# EAGLE design charger v1 (EAGLE 5.10)
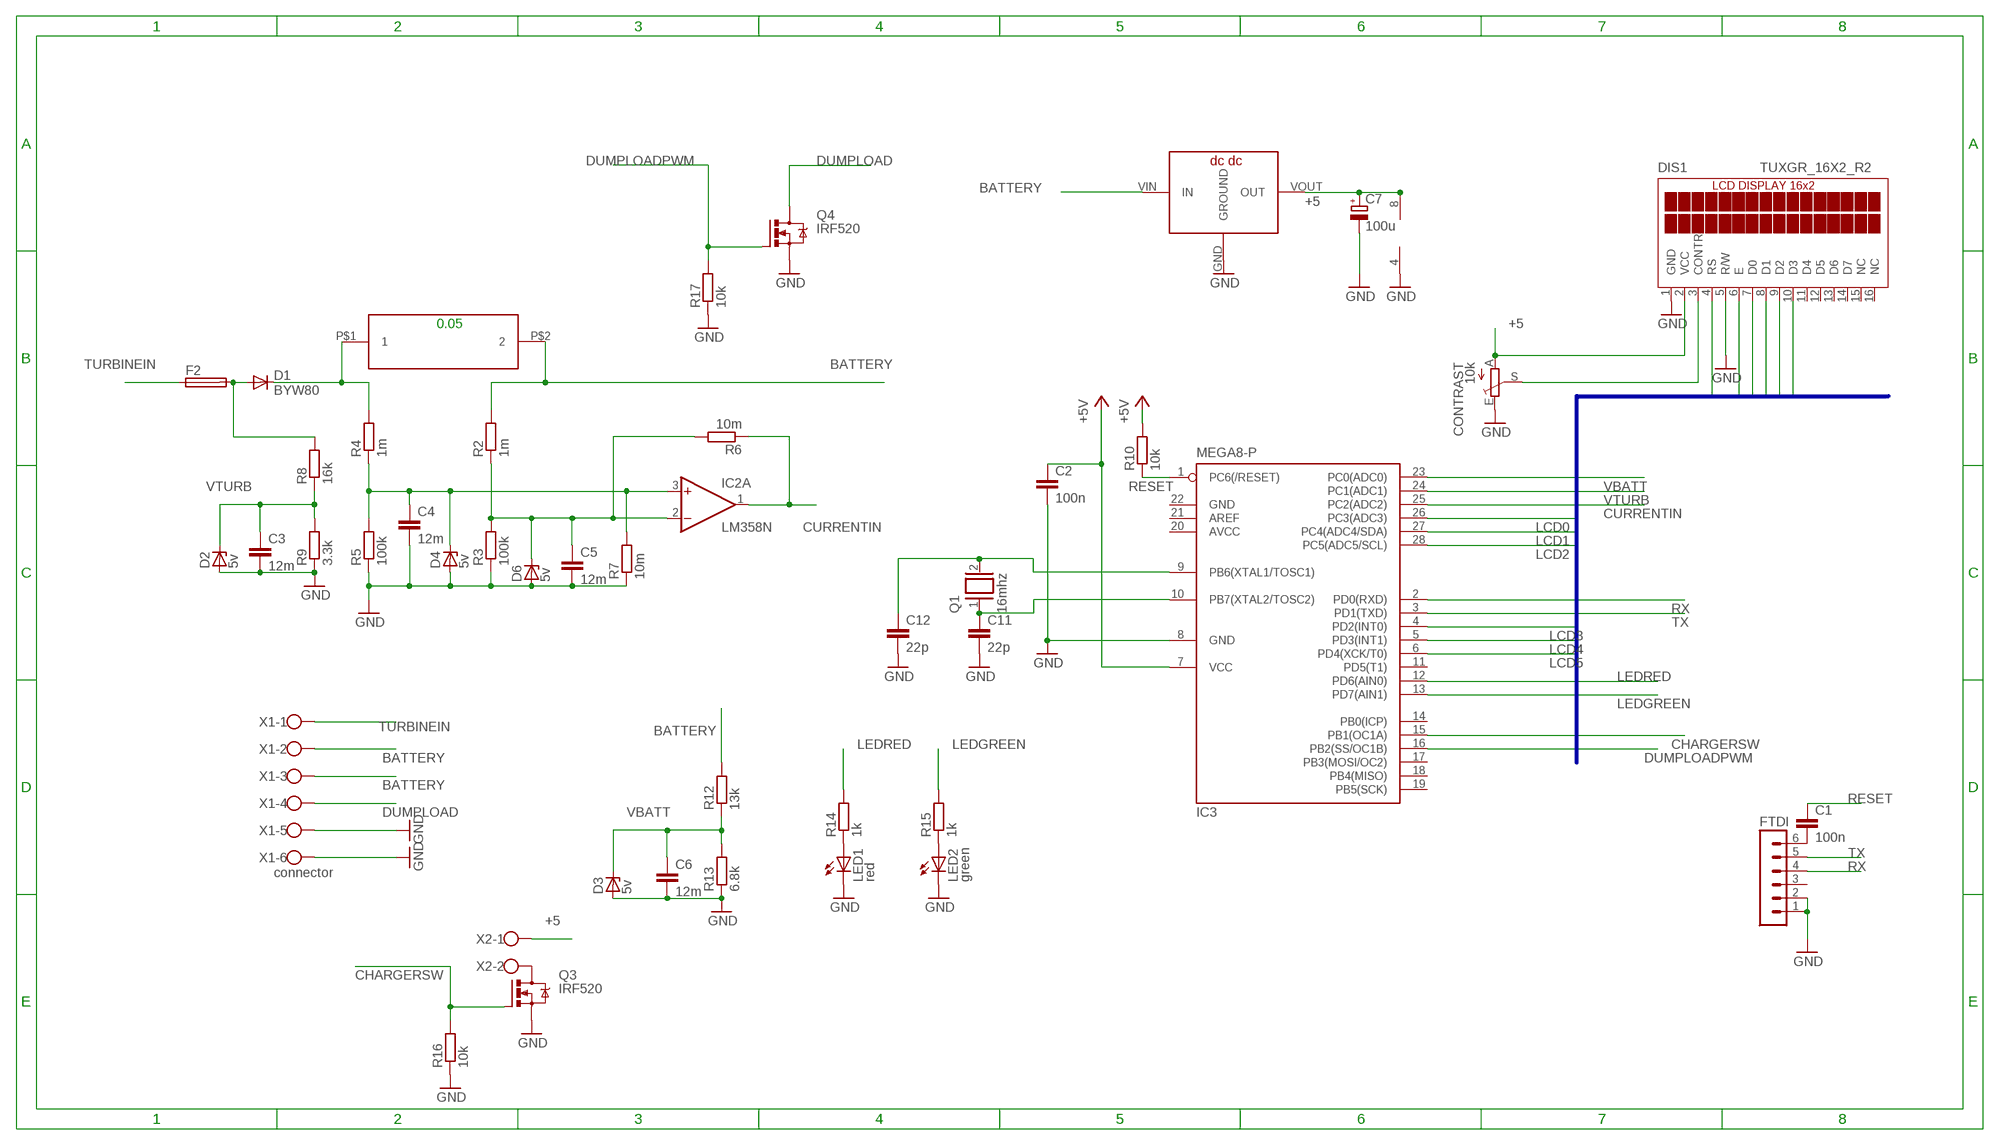
[diagram p0: schematic, sheet 1]

## Parts
C1  100n  C5/2.5  [C5B2.5]
C2  100n  C5/2.5  [C5B2.5]
C3  12m  C5/2.5  [C5B2.5]
C4  12m  C5/2.5  [C5B2.5]
C5  12m  C5/2.5  [C5B2.5]
C6  12m  C5/2.5  [C5B2.5]
C7  100u  CPOL-EUE2,5-6E  [E2,5-6E]
C11  22p  C-EU050-025X075  [C050-025X075]
C12  22p  C-EU050-025X075  [C050-025X075]
CONTRAST  10k  TRIM_EU-CA9V  [CA9V]
D1  BYW80  [TO220ACS]
D2  5v  ZENER-DIODEDO34-7  [DO34Z7]
D3  5v  ZENER-DIODEDO34-7  [DO34Z7]
D4  5v  ZENER-DIODEDO34-7  [DO34Z7]
D6  5v  ZENER-DIODEDO34-7  [DO34Z7]
DIS1  TUXGR_16X2_R2  [TUXGR_16X2_R2]
F2  SH22,5  [SH22,5]
FTDI  MA06-1  [MA06-1]
IC2  LM358N  [DIL08]
IC3  MEGA8-P  [DIL28-3]
LED1  red  LED5MM  [LED5MM]
LED2  green  LED5MM  [LED5MM]
Q1  16mhz  XTAL/S  [QS]
Q3  IRF520  [TO220BV]
Q4  IRF520  [TO220BV]
R2  1m  R-EU_0204/7  [0204/7]
R3  100k  R-EU_0204/7  [0204/7]
R4  1m  R-EU_0204/7  [0204/7]
R5  100k  R-EU_0204/7  [0204/7]
R6  10m  R-EU_0204/7  [0204/7]
R7  10m  R-EU_0204/7  [0204/7]
R8  16k  R-EU_0204/7  [0204/7]
R9  3.3k  R-EU_0204/7  [0204/7]
R10  10k  R-EU_0204/7  [0204/7]
R12  13k  R-EU_0204/7  [0204/7]
R13  6.8k  R-EU_0204/7  [0204/7]
R14  1k  R-EU_0204/7  [0204/7]
R15  1k  R-EU_0204/7  [0204/7]
R16  10k  R-EU_0204/7  [0204/7]
R17  10k  R-EU_0204/7  [0204/7]
U$1  R-5MM  [R-5MM]
U$2  TSR1-DCDC  [TSR1-DCDC]
X1  connector  W237-6  [W237-6]
X2  W237-102  [W237-102]

## Nets
+5: C2.1 C7.+ CONTRAST.A DIS1.2(VCC) IC2.8(P:V+) IC3.7(VCC) R10.2 U$2.VOUT(OUT) X2.1 ; supply symbol labelled +5V
BATTERY [power]: R2.2 R12.2 U$1.P$2 U$2.VIN(IN) X1.2 X1.3
CHARGERSW: IC3.15(PB1(OC1A)) Q3.G R16.2
CURRENTIN: IC2.1(A:OUT) IC3.25(PC2(ADC2)) R6.1
DUMPLOAD [power]: Q4.D X1.4
DUMPLOADPWM: IC3.16(PB2(SS/OC1B)) Q4.G R17.2
GND: C2.2 C3.2 C4.2 C5.2 C6.2 C7.- C11.2 C12.2 CONTRAST.E D2.A D3.A D4.A D6.A DIS1.1(GND) DIS1.5(R/W) FTDI.1 FTDI.2 IC2.4(P:V-) IC3.8(GND) LED1.K(C) LED2.K(C) Q3.S Q4.S R3.1 R5.1 R7.1 R9.1 R13.1 R16.1 R17.1 U$2.GND(GROUND) X1.5 X1.6
LCD0: DIS1.4(RS) IC3.26(PC3(ADC3))
LCD1: DIS1.6(E) IC3.27(PC4(ADC4/SDA))
LCD2: DIS1.7(D0) IC3.28(PC5(ADC5/SCL))
LCD3: DIS1.8(D1) IC3.4(PD2(INT0))
LCD4: DIS1.9(D2) IC3.5(PD3(INT1))
LCD5: DIS1.10(D3) IC3.6(PD4(XCK/T0))
LEDGREEN: IC3.13(PD7(AIN1)) R15.2
LEDRED: IC3.12(PD6(AIN0)) R14.2
N$1 [power]: D1.C R4.2 U$1.P$1
N$3: D1.A F2.2 R8.2
N$5: C1.2 FTDI.6
N$6: Q3.D X2.2
N$9: CONTRAST.S DIS1.3(CONTR)
N$10: C11.1 IC3.10(PB7(XTAL2/TOSC2)) Q1.1
N$11: C12.1 IC3.9(PB6(XTAL1/TOSC1)) Q1.2
N$13: LED1.A R14.1
N$15: LED2.A R15.1
N$16 [power]: C4.1 D4.C IC2.3(A:+IN) R4.1 R5.2 R7.2
N$17 [power]: C5.1 D6.C IC2.2(A:-IN) R2.1 R3.2 R6.2
RESET: C1.1 IC3.1(PC6(/RESET)) R10.1
RX: FTDI.4 IC3.2(PD0(RXD))
TURBINEIN [power]: F2.1 X1.1
TX: FTDI.5 IC3.3(PD1(TXD))
VBATT: C6.1 D3.C IC3.23(PC0(ADC0)) R12.1 R13.2
VTURB: C3.1 D2.C IC3.24(PC1(ADC1)) R8.1 R9.2
Unconnected: DIS1.11(D4) DIS1.12(D5) DIS1.13(D6) DIS1.14(D7) DIS1.15(NC) DIS1.16(NC) FTDI.3 IC2.5(B:+IN) IC2.6(B:-IN) IC2.7(B:OUT) IC3.11(PD5(T1)) IC3.14(PB0(ICP)) IC3.17(PB3(MOSI/OC2)) IC3.18(PB4(MISO)) IC3.19(PB5(SCK)) IC3.21(AREF)

## Buses
LCD[0..5]

## Notes on the sheet
- 0.05

## Power pins joined to a net without a drawn wire
AVCC: IC3.20(AVCC)
GND: IC3.22(GND)

## Library data of the parts
C1-C6 = capacitor-wima:C: CAPACITOR naming: grid - package width
C7 = rcl:CPOL-EU: POLARIZED CAPACITOR, European symbol
C11 C12 = rcl:C-EU: CAPACITOR, European symbol
CONTRAST = pot:TRIM_EU-: POTENTIOMETER
D1 = diode:BYW80: DIODE high-efficiency fast recovery rectifier (ST)
D2-D4 D6 = diode:ZENER-DIODE: Z-Diode
DIS1 = display-lcd:TUXGR_16X2_R2: Tuxgraphics LCD display 16x2 characters reflective, without background light Source: tuxgr_12x2_r2.pdf
F2 = fuse:SH22,5: FUSE HOLDER grid 22,5 mm, OGN0031 8201, Schurter (Buerklin)
FTDI = con-lstb:MA06-1: PIN HEADER
IC2 = linear:LM358: OP AMP also LM158; LM258; LM2904 Source: http://cache.national.com/ds/LM/LM158.pdf
IC3 = atmel:MEGA8-P: MICROCONTROLLER 8 Kbytes FLASH, 1 kbytes SRAM, 512 bytes EEPROM, USART, 4-channel 10 bit ADC, 2-channel 8 bit ADC Pin compatible with Atmega48, ATMega88, ATMega168 Source: avr.lbr
LED1 LED2 = led:LED: LED OSRAM: - CHIPLED LG R971, LG N971, LY N971, LG Q971, LY Q971, LO R971, LY R971 LH N974, LH R974 LS Q976, LO Q976, LY Q976 LO Q996 - Hyper CHIPLED LW Q18S LB Q993, LB Q99A, LB R99A - SideLED LS A670, LO A670, LY A670, LG A670, LP A670 LB A673, LV A673, LT A673, LW A673 LH A674 LY A675 LS A676, LA A676, LO A676, LY A676, LW A676 LS A679, LY A679, LG A679 - Hyper Micro SIDELED® LS Y876, LA Y876, LO Y876, LY Y876 LT Y87S - SmartLED LW L88C, LW L88S LB L89C, LB L89S, LG L890 LS L89K, LO L89K, LY L89K LS L896, LA L896, LO L896, LY L896 - TOPLED LS T670, LO T670, LY T670, LG T670, LP T670 LSG T670, LSP T670, LSY T670, LOP T670, LYG T670 LG T671, LOG T671, LSG T671 LB T673, LV T673, LT T673, LW T673 LH T674 LS T676, LA T676, LO T676, LY T676, LB T676, LH T676, LSB T676, LW T676 LB T67C, LV T67C, LT T67C, LS T67K, LO T67K, LY T67K, LW E67C LS E67B, LA E67B, LO E67B, LY E67B, LB E67C, LV E67C, LT E67C LW T67C LS T679, LY T679, LG T679 LS T770, LO T770, LY T770, LG T770, LP T770 LB T773, LV T773, LT T773, LW T773 LH T774 LS E675, LA E675, LY E675, LS T675 LS T776, LA T776, LO T776, LY T776, LB T776 LHGB T686 LT T68C, LB T68C - Hyper Mini TOPLED® LB M676 - Mini TOPLED Santana® LG M470 LS M47K, LO M47K, LY M47K Source: http://www.osram.convergy.de LUXEON: - LUMILED® LXK2-PW12-R00, LXK2-PW12-S00, LXK2-PW14-U00, LXK2-PW14-V00 LXK2-PM12-R00, LXK2-PM12-S00, LXK2-PM14-U00 LXK2-PE12-Q00, LXK2-PE12-R00, LXK2-PE12-S00, LXK2-PE14-T00, LXK2-PE14-U00 LXK2-PB12-K00, LXK2-PB12-L00, LXK2-PB12-M00, LXK2-PB14-N00, LXK2-PB14-P00, LXK2-PB14-Q00 LXK2-PR12-L00, LXK2-PR12-M00, LXK2-PR14-Q00, LXK2-PR14-R00 LXK2-PD12-Q00, LXK2-PD12-R00, LXK2-PD12-S00 LXK2-PH12-R00, LXK2-PH12-S00 LXK2-PL12-P00, LXK2-PL12-Q00, LXK2-PL12-R00 Source: www.luxeon.com KINGBRIGHT: KA-3528ASYC Source: www.kingbright.com
Q1 = special:XTAL/S: CRYSTAL
Q3 Q4 = transistor-power:IRF520: HEXFET Power MOSFET
R2-R10 R12-R17 = rcl:R-EU_: RESISTOR, European symbol
U$1 = matt:R-5MM
U$2 = matt:TSR1-DCDC: traco dc/dc converter tsr-1 series
X1 = con-wago-500:W237-6: WAGO SCREW CLAMP
X2 = con-wago-500:W237-102: WAGO SCREW CLAMP

## Net classes
1 power: width 2 mm

## Board
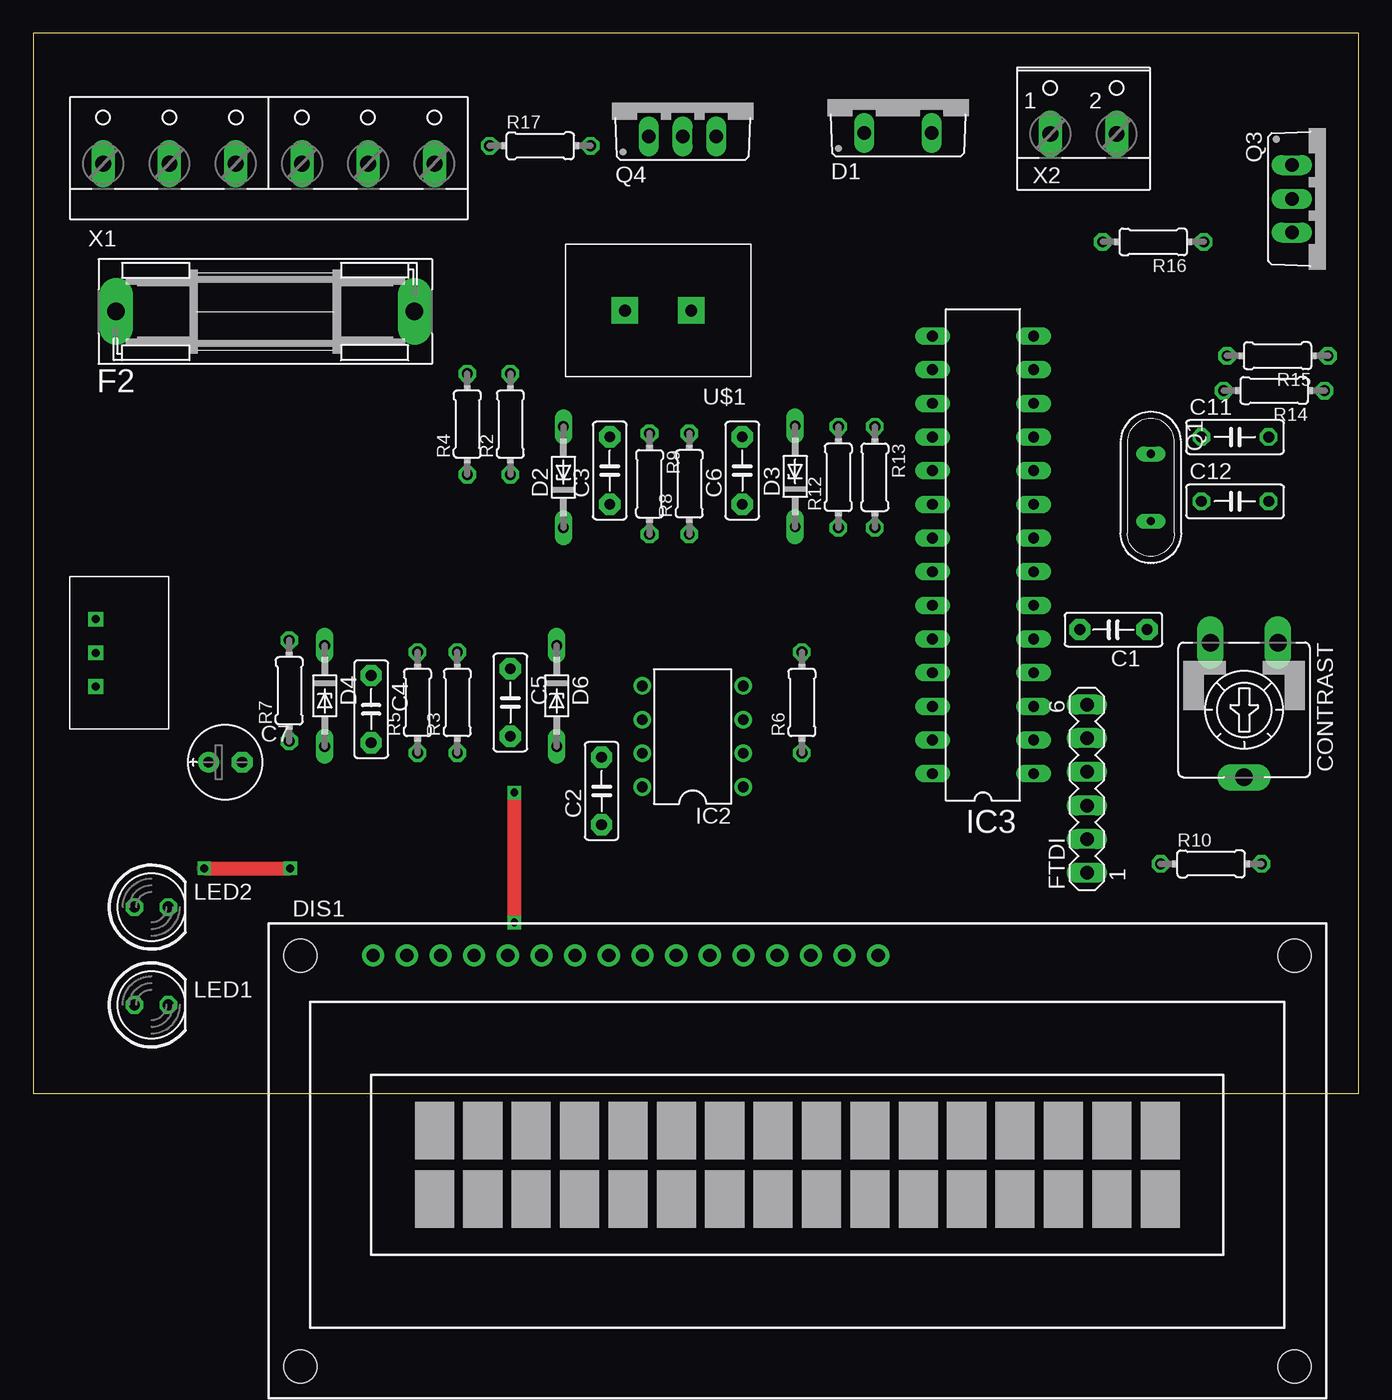
[diagram p1: board, top side]
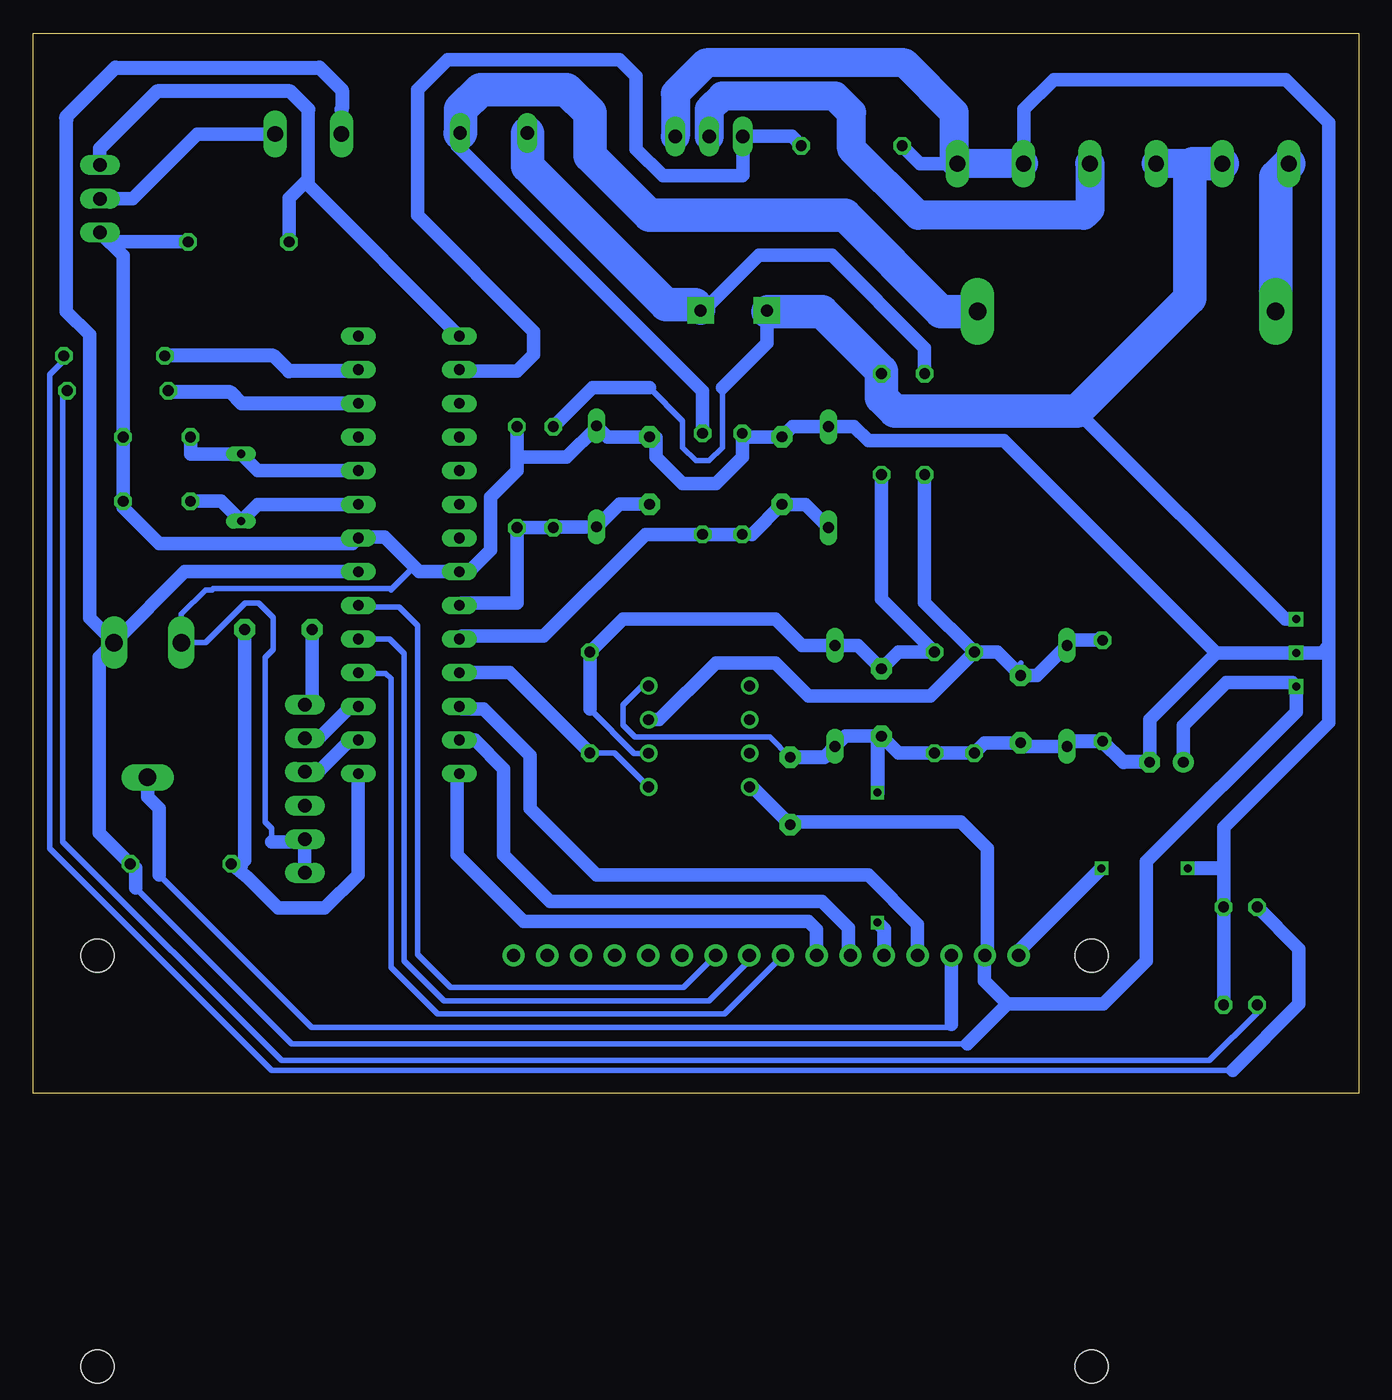
[diagram p2: board, bottom side, seen from below]

Size 100 x 80 mm. Coordinates in mm from the lower left corner, seen from the top.
Outline: 0,0 100,0 100,80 0,80 0,0
Copper layers (1*16): Top 0.035mm / dielectric 1.5mm / Bottom 0.035mm
Design rules "default *": minimum track width 10mil, minimum drill 24mil, track to track 8mil, track to pad 8mil, pad to pad 8mil, via to via 8mil, smd to smd 8mil, copper to edge 40mil, drill to drill 8mil, minimum pad ring 10mil, minimum via ring 8mil, stop-mask expansion 4mil, vias tented up to drill 0mil, thermal gap 10mil

### Footprints (pad centres in the part's own frame; a part is rotated, then mirrored left to right if it is on the bottom)
C5B2.5 = drill 0.813 pad 1.6 octagon: 1 -2.54,0; 2 2.54,0
E2,5-6E = drill 0.813 pad 1.575 round: + -1.27,0 | drill 0.813 pad 1.575 octagon: - 1.27,0
C050-025X075 = drill 0.813 octagon: 1 -2.54,0; 2 2.54,0
CA9V = drill 1.321 long: A -2.54,-5.08; E 2.54,-5.08; S 0,5.08
TO220ACS = drill 1.016 long: A 2.54,-2.54; C -2.54,-2.54
DO34Z7 = drill 0.813 long: A 3.81,0; C -3.81,0
TUXGR_16X2_R2 = drill 1 pad 1.676 round: 1 -32,15.5; 2 -29.46,15.5; 3 -26.92,15.5; 4 -24.38,15.5; 5 -21.84,15.5; 6 -19.3,15.5; 7 -16.76,15.5; 8 -14.22,15.5; 9 -11.68,15.5; 10 -9.14,15.5; 11 -6.6,15.5; 12 -4.06,15.5; 13 -1.52,15.5; 14 1.02,15.5; 15 3.56,15.5; 16 6.1,15.5 | hole 2.5: -37.5,-15.5; 37.5,-15.5; -37.5,15.5; 37.5,15.5
SH22,5 = drill 1.321 pad 2.54 long: 1 -11.252,0; 2 11.252,0
MA06-1 = drill 1.016 long: 1 -6.35,0; 2 -3.81,0; 3 -1.27,0; 4 1.27,0; 5 3.81,0; 6 6.35,0
DIL08 = drill 0.813 pad 1.27 round: 1 -3.81,-3.81; 2 -1.27,-3.81; 3 1.27,-3.81; 4 3.81,-3.81; 5 3.81,3.81; 6 1.27,3.81; 7 -1.27,3.81; 8 -3.81,3.81
DIL28-3 = drill 0.813 long: 1 -16.51,-3.81; 2 -13.97,-3.81; 3 -11.43,-3.81; 4 -8.89,-3.81; 5 -6.35,-3.81; 6 -3.81,-3.81; 7 -1.27,-3.81; 8 1.27,-3.81; 9 3.81,-3.81; 10 6.35,-3.81; 11 8.89,-3.81; 12 11.43,-3.81; 13 13.97,-3.81; 14 16.51,-3.81; 15 16.51,3.81; 16 13.97,3.81; 17 11.43,3.81; 18 8.89,3.81; 19 6.35,3.81; 20 3.81,3.81; 21 1.27,3.81; 22 -1.27,3.81; 23 -3.81,3.81; 24 -6.35,3.81; 25 -8.89,3.81; 26 -11.43,3.81; 27 -13.97,3.81; 28 -16.51,3.81
LED5MM = drill 0.813 octagon: A -1.27,0; K 1.27,0
QS = drill 0.61 long: 1 -2.54,0; 2 2.54,0
TO220BV = drill 1.016 long: D 0,-2.54; G -2.54,-2.54; S 2.54,-2.54
0204/7 = drill 0.813 octagon: 1 -3.81,0; 2 3.81,0
R-5MM = drill 0.9 pad 2 square: P$1 -2.5,0; P$2 2.5,0
TSR1-DCDC = drill 0.6 square: GND -0.254,2.032; VIN 2.286,2.032; VOUT -2.794,2.032
W237-6 = drill 1.194 long: 1 -12.5,-1.27; 2 -7.5,-1.27; 3 -2.5,-1.27; 4 2.5,-1.27; 5 7.5,-1.27; 6 12.5,-1.27
W237-102 = drill 1.194 long: 1 -2.5,-1.27; 2 2.5,-1.27

### Placement (x,y rotation side)
C1  81.5,35 180 top
C2  42.89,22.83 90 top
C3  43.5,47 90 top
C4  25.5,29 270 top
C5  36,29.5 270 top
C6  53.5,47 90 top
C7  14.5,25 0 top
C11  90.67,49.53 0 top
C12  90.67,44.68 0 top
CONTRAST  91.36,28.94 180 top
D1  65.25,75 0 top
D2  40,46.5 90 top
D3  57.49,46.56 90 top
D4  22,30 270 top
D6  39.5,30 270 top
DIS1  57.65,-5.08 0 top
F2  17.51,59 0 top
FTDI  79.5,23 90 top
IC2  49.76,26.94 90 top
IC3  71.66,40.64 90 top
LED1  8.92,6.69 0 top
LED2  8.92,14.07 0 top
Q1  84.32,45.72 270 top
Q3  97.5,67.5 270 top
Q4  49,74.75 0 top
R2  36,50.5 90 top
R3  32,29.5 90 top
R4  32.75,50.5 90 top
R5  29,29.5 90 top
R6  58,29.5 90 top
R7  19.32,30.39 90 top
R8  49.5,46 90 top
R9  46.5,46 270 top
R10  88.86,17.33 0 top
R12  60.75,46.5 90 top
R13  63.5,46.5 270 top
R14  93.62,53.03 180 top
R15  93.88,55.66 180 top
R16  84.5,64.25 180 top
R17  38.25,71.5 0 top
U$1  47.15,59.07 180 top
U$2  6.75,33.5 90 top
X1  17.78,71.43 0 top
X2  79.24,73.66 0 top

### Tracks (layer width: path | path; a pad name or v marks a point on that pad's centre or on a via)
+5
  Bottom 0.406: 28,11 28.5,10.5 28.27,10.5 DIS1.2 | 42.68,20.5 C2.1 | 45.73,23.13 IC2.8 | 92.25,15.5 80.5,3.75 29.5,3.75
  Bottom 1.016: CONTRAST.A 95,32.92 95,19.66 R10.2 92.56,17.33 92.25,17.02 92.25,15.5 | IC3.7 88.55,39.37 CONTRAST.A | C7.+ 13.23,27.77 10,31 5.01,31 U$2.VOUT 4.72,28.78 16,17.5 16,10 19.25,6.75 26.5,6.75 | 28,11 28,18.5 30,20.5 42.68,20.5 | C2.1 45.73,23.13 | 76.74,74.24 X2.1 | CONTRAST.A 94.5,34.62 | 97.5,73.5 97.5,59 95.75,57.25 95.75,35.87 CONTRAST.A | 26.5,6.75 28.25,8.5 28.25,10.36 DIS1.2 | 26.5,6.75 29.5,3.75
  Bottom 1.05: 97.5,73.5 97.5,73.7 93.8,77.4 78.4,77.4 76.7,75.7 76.7,74.28 76.74,74.24
BATTERY
  Bottom 0.406: 48,53.25 48,48.75 49,47.75 50,47.75 51,48.75 51,50.75 53.5,53.25
  Bottom 1.016: U$1.P$2 44.65,56.6 48,53.25 | U$2.VIN 5.54,35.79 21.25,51.5 | 53.5,53.25 57.81,53.25 R12.2
  Bottom 2.184: R2.2 36,54.5 | 44.58,59 U$1.P$2 | 12.75,69.91 12.5,70.16 | 12.25,70.16 X1.3
  Bottom 2.54: 12.5,70.16 12.25,70.16 X1.2 | 36,54.5 40.5,59 44.58,59 | R2.2 36,52.5 35,51.5 21.25,51.5 12.75,60 12.75,69.91
CHARGERSW
  Bottom 0.406: Q3.G 95.31,70.39
  Bottom 1.016: 94.96,71.29 Q3.G | 79.25,69 79.25,68.55 IC3.15 | 79.25,69 79.25,74.25 | R16.2 80.69,67.56 79.25,69
  Bottom 1.05: 79.25,74.25 80.6,75.6 90.65,75.6 94.96,71.29
CURRENTIN
  Bottom 0.406: R6.1 56.13,25.69 IC2.1
  Bottom 1.016: IC3.25 64.06,31.75 R6.1
DUMPLOAD
  Bottom 2.184: Q4.D 49,74.25 48,75.25 39.5,75.25 38.25,74 38.25,71.25 33.25,66.25 20.75,66.25 20.25,66.75 20.25,70.13 X1.4
DUMPLOADPWM
  Bottom 1.016: R17.2 42.77,72.21 Q4.G 46.46,69.29 46.5,69.25 52.5,69.25 54.5,71.25 54.5,76.75 55.75,78 68.75,78 71,75.75 71,66.25 62.25,57.5 62.25,55.75 63.5,54.5 67.74,54.5 IC3.16
GND  (via drill 0.6)
  Top 1.05: v12.9,17 v19.4,17 | v36.3,22.7 v36.3,12.9
  Bottom 0.406: 75.38,42 IC3.8 | C6.2 53.04,49.54 53,49.5 | 23.5,26.19 23.69,26 | 72.9,38.1 73,38 | 82,19 82,20 82.5,20.5 82.5,32.9 81.9,33.5 81.9,35.9 83,37 84,37 86.98,34.02 CONTRAST.E 88.82,36.18 87,38 86.5,38 86.4,38.1 72.9,38.1 | 71.25,39.75 72.9,38.1 | IC2.4 54.05,30.75 55.5,29.3 55.5,27.8 54.6,26.9 44.42,26.9 C2.2
  Bottom 1.016: IC3.8 75.88,41.5 90.5,41.5 93.21,44.21 C12.2 C11.2 93.21,63.21 Q3.S | FTDI.1 FTDI.2 79.5,19 82,19 | Q3.S 94.53,64.96 | 75.38,42 73.5,42 71.25,39.75 70.87,39.37 IC3.22 67.72,39.5 67,39.5 65.5,41 65.5,45 63.5,47 63.5,48 | LED1.K LED2.K 10.19,17.3 10.19,20.06 2.25,28 2.25,33.75 | D4.A 23.5,26.19 25.23,26.19 C4.2 28.23,26.46 R5.1 R3.1 34.73,25.69 C5.2 38.73,26.96 D6.A | C6.2 56.66,49.54 D3.A 57.49,50.26 59.75,48 63.5,48 | 63.5,48 R13.1 | 53,49.5 53,48 51,46 48.5,46 46.5,48 R9.1 46.23,49.54 C3.2 42.73,50.31 D2.A 38.06,50.31 37,49.25 26.75,49.25 10.75,33.25 | X1.6 33.1,70.16 R17.1 | C7.- 15.77,28.23 10.75,33.25 | U$2.GND 10.75,33.25 | U$2.GND | R16.1 94.25,64.25 Q3.S | 2.25,33.75 2.25,73.25 5.5,76.5 23,76.5 25.25,74.25 25.25,70.19 X1.5 | U$2.GND 2.75,33.25 2.25,33.75
  Bottom 1.05: DIS1.1 25.65,10.75 v19.4,17 | v12.9,17 10.49,17 10.19,17.3 | C2.2 40.32,25.37 D6.A | C7.- 17.74,25 R7.1 21.61,26.58 D4.A | DIS1.5 35.81,12.41 v36.3,12.9 | v36.3,22.7 36.3,26.66 C5.2
  Bottom 2.184: Q4.S 51.54,75.46 49.25,77.75 34.25,77.75 30.5,74 30.5,70.38 X1.6 X1.5
LCD0
  Bottom 1.016: DIS1.4 33.27,12.77 37,16.5 57.5,16.5 62.5,21.5 62.5,25.5 66,29 67.64,29 IC3.26
LCD1
  Bottom 1.016: IC3.27 66.67,26.67 64.5,24.5 64.5,18 61,14.5 40.5,14.5 38.5,12.5 38.5,10.57 DIS1.6
LCD2
  Bottom 1.016: DIS1.7 40.89,12.39 41.5,13 63,13 68,18 68,23.98 IC3.28
LCD3
  Bottom 0.406: 75.25,31.75 IC3.4 75.42,31.7 73.4,31.7 73,31.3 73,9.5 69.5,6 47.85,6 DIS1.8
LCD4
  Bottom 0.406: DIS1.9 45.97,10.03 49,7 69,7 72,10 72,33.2 73.1,34.3 IC3.5
LCD5
  Bottom 0.406: DIS1.10 50.93,8 68.5,8 71,10.5 71,35.3 72.4,36.7 75.34,36.7 IC3.6 74.33,36.83
LEDGREEN
  Bottom 0.406: IC3.13 75.58,54.5
  Bottom 1.05: R15.2 81.86,55.66 80.7,54.5 75.58,54.5
LEDRED
  Bottom 0.406: 89.68,52.9 R14.2
  Bottom 1.05: IC3.12 84.27,52.07 85.1,52.9 89.68,52.9
N$1
  Bottom 1.016: U$1.P$1 49.43,59.07 45.25,63.25 39.75,63.25 32.75,56.25 R4.2
  Bottom 2.184: U$1.P$1 50.08,59.5
  Bottom 2.54: D1.C 62.71,69.96 52.25,59.5 50.08,59.5
N$3
  Bottom 1.016: D1.A 68,72.25 68,71.5 49.5,53 R8.2
  Bottom 2.54: F2.2 31.5,59 38.75,66.25 53.5,66.25 58,70.75 58,74 59.75,75.75 66.25,75.75 67.75,74.25 67.75,72.5 D1.A
N$5
  Bottom 0.406: FTDI.6 78.96,29.89
  Bottom 1.016: 78.96,29.89 C1.2
N$6
  Bottom 1.016: X2.2 87.61,72.39 92.5,67.5 Q3.D
N$9
  Bottom 0.406: 30.73,5.23 31,5 79,5 90.5,16.5
  Bottom 1.016: 30.73,5.23 DIS1.3 | CONTRAST.S 91.36,22.36 90.5,21.5 90.5,16.5
N$10
  Bottom 1.016: IC3.10 83.05,46.99 Q1.1 88.13,48.26 C11.1
N$11
  Bottom 1.016: IC3.9 83.05,44.45 Q1.2 85.82,44.68 C12.1
N$13
  Bottom 0.406: LED1.A 7.65,6.1 11.25,2.5 81.25,2.5 97.75,19 97.75,52.71 R14.1
N$15
  Bottom 0.406: R15.1 97.69,55.31 98.75,54.25 98.75,18.5 82,1.75 9.5,1.75
  Bottom 1.016: 9.5,1.75 4.5,6.75 4.5,10.92 LED2.A
N$16
  Bottom 0.406: C4.1 25.98,32.02 25.5,32.5 | 21.61,34.2 D4.C
  Bottom 1.016: R5.2 27.27,33.31 25.98,32.02 | IC2.3 52.79,28.21 48.5,32.5 44,32.5 41.5,30 32.31,30 R5.2 | 21.61,34.2 R7.2 19.5,34.38 | C4.1 24.27,31.54 D4.C | R4.1 32.75,37.06 R5.2
N$17
  Bottom 0.406: IC2.2 54.67,25.67 58,29
  Bottom 1.016: R6.2 57.5,33.81 | R6.2 58,29 | R2.1 36,37.31 R3.2 34.73,33.31 C5.1 37.77,33.81 D6.C 42.01,33.81 44,35.8 55.51,35.8 R6.2
RESET
  Bottom 0.406: 84,17.11 R10.1 84.04,17.59 | 75.5,24.1 IC3.1
  Bottom 1.016: R10.1 83.78,16.28 81.5,14 78,14 75.5,16.5 75.5,24.1 | 84.04,17.59 C1.1
RX
  Bottom 1.016: IC3.2 76.08,26.67 78.5,24.25 79.48,24.25 FTDI.4
TURBINEIN
  Bottom 2.54: F2.1 6.26,69.18 X1.1
TX
  Bottom 1.016: IC3.3 76.04,29.21 78.5,26.75 79.44,26.75 FTDI.5
VBATT
  Bottom 1.016: C6.1 54.51,44.46 55.78,44.46 D3.C 60.94,42.75 R12.1 R13.2 63.5,37 67.68,37 IC3.23
VTURB
  Bottom 0.406: 45.77,42.19 R9.2 | 67.64,34.5 IC3.24 | 43.5,44.42 C3.1
  Bottom 1.016: R9.2 R8.1 53.81,42.19 61.5,34.5 67.64,34.5 | C3.1 45.77,42.19 | 43.5,44.42 41.73,44.42 D2.C